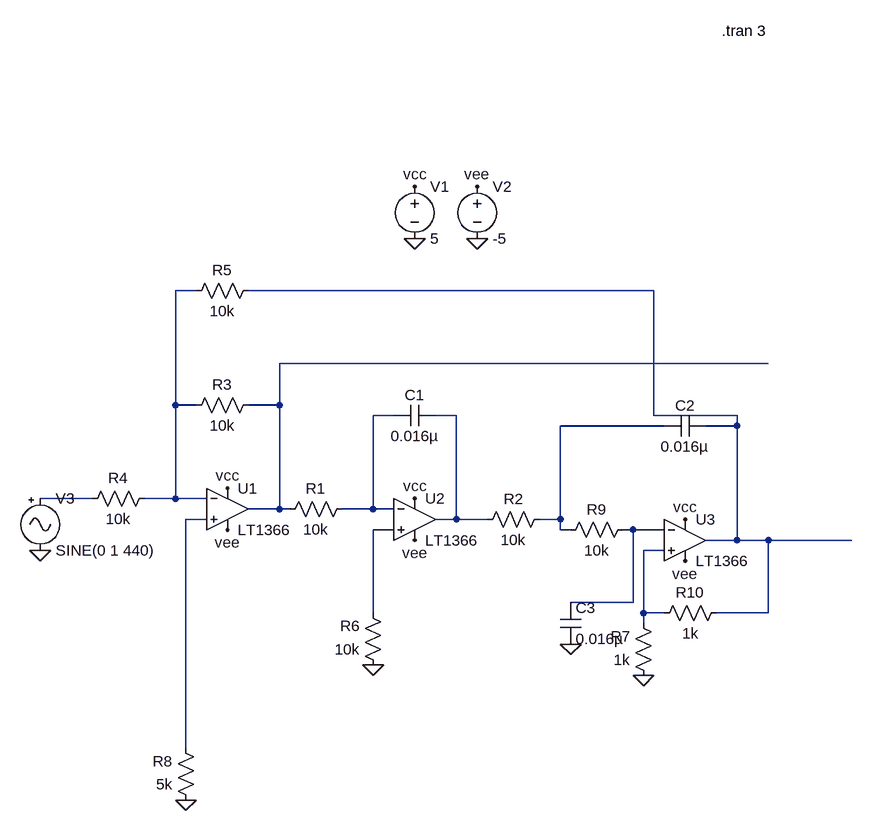
[diagram p0: schematic Draft35.asc]
Draft35.asc, the LTspice schematic file:
Version 4
SHEET 1 964 896
WIRE -48 96 -80 96
WIRE 656 96 32 96
WIRE 832 208 80 208
WIRE -80 272 -80 96
WIRE -48 272 -80 272
WIRE 80 272 80 208
WIRE 80 272 32 272
WIRE 256 288 224 288
WIRE 352 288 320 288
WIRE 656 288 656 96
WIRE 784 288 656 288
WIRE 672 304 512 304
WIRE 784 304 784 288
WIRE 784 304 736 304
WIRE -208 416 -288 416
WIRE -80 416 -80 272
WIRE -80 416 -128 416
WIRE -32 416 -80 416
WIRE 80 432 80 272
WIRE 80 432 32 432
WIRE 96 432 80 432
WIRE 224 432 224 288
WIRE 224 432 176 432
WIRE 256 432 224 432
WIRE -32 448 -64 448
WIRE 352 448 352 288
WIRE 352 448 320 448
WIRE 400 448 352 448
WIRE 512 448 512 304
WIRE 512 448 480 448
WIRE 256 464 224 464
WIRE 512 464 512 448
WIRE 528 464 512 464
WIRE 624 464 608 464
WIRE 672 464 624 464
WIRE 784 480 784 304
WIRE 784 480 736 480
WIRE 832 480 784 480
WIRE 960 480 832 480
WIRE 672 496 640 496
WIRE 624 576 624 464
WIRE 624 576 528 576
WIRE 224 592 224 464
WIRE 640 592 640 496
WIRE 672 592 640 592
WIRE 832 592 832 480
WIRE 832 592 752 592
WIRE 640 608 640 592
WIRE -64 800 -64 448
FLAG 384 16 0
FLAG 288 16 0
FLAG 288 -64 vcc
FLAG 384 -64 vee
FLAG 0 400 vcc
FLAG 288 416 vcc
FLAG 704 448 vcc
FLAG 704 512 vee
FLAG 288 480 vee
FLAG 0 464 vee
FLAG -64 880 0
FLAG 224 672 0
FLAG 640 688 0
FLAG -288 496 0
FLAG 528 640 0
SYMBOL voltage 288 -80 R0
SYMATTR InstName V1
SYMATTR Value 5
SYMBOL voltage 384 -80 R0
SYMATTR InstName V2
SYMATTR Value -5
SYMBOL Opamps/LT1366 0 368 R0
SYMATTR InstName U1
SYMBOL Opamps/LT1366 288 384 R0
SYMATTR InstName U2
SYMBOL Opamps/LT1366 704 416 R0
SYMATTR InstName U3
SYMBOL res 192 416 R90
WINDOW 0 0 56 VBottom 2
WINDOW 3 32 56 VTop 2
SYMATTR InstName R1
SYMATTR Value 10k
SYMBOL res 496 432 R90
WINDOW 0 0 56 VBottom 2
WINDOW 3 32 56 VTop 2
SYMATTR InstName R2
SYMATTR Value 10k
SYMBOL res 48 256 R90
WINDOW 0 0 56 VBottom 2
WINDOW 3 32 56 VTop 2
SYMATTR InstName R3
SYMATTR Value 10k
SYMBOL res -112 400 R90
WINDOW 0 0 56 VBottom 2
WINDOW 3 32 56 VTop 2
SYMATTR InstName R4
SYMATTR Value 10k
SYMBOL res 48 80 R90
WINDOW 0 0 56 VBottom 2
WINDOW 3 32 56 VTop 2
SYMATTR InstName R5
SYMATTR Value 10k
SYMBOL res 240 688 R180
WINDOW 0 36 76 Left 2
WINDOW 3 36 40 Left 2
SYMATTR InstName R6
SYMATTR Value 10k
SYMBOL res 656 704 R180
WINDOW 0 36 76 Left 2
WINDOW 3 36 40 Left 2
SYMATTR InstName R7
SYMATTR Value 1k
SYMBOL res -48 896 R180
WINDOW 0 36 76 Left 2
WINDOW 3 36 40 Left 2
SYMATTR InstName R8
SYMATTR Value 5k
SYMBOL cap 320 272 R90
WINDOW 0 0 32 VBottom 2
WINDOW 3 32 32 VTop 2
SYMATTR InstName C1
SYMATTR Value 0.016µ
SYMBOL cap 736 288 R90
WINDOW 0 0 32 VBottom 2
WINDOW 3 32 32 VTop 2
SYMATTR InstName C2
SYMATTR Value 0.016µ
SYMBOL Misc/signal -288 400 R0
SYMATTR InstName V3
SYMATTR Value SINE(0 1 440)
SYMBOL res 624 448 R90
WINDOW 0 0 56 VBottom 2
WINDOW 3 32 56 VTop 2
SYMATTR InstName R9
SYMATTR Value 10k
SYMBOL cap 512 576 R0
SYMATTR InstName C3
SYMATTR Value 0.016µ
SYMBOL res 768 576 R90
WINDOW 0 0 56 VBottom 2
WINDOW 3 32 56 VTop 2
SYMATTR InstName R10
SYMATTR Value 1k
TEXT 760 -304 Left 2 !.tran 3

The netlist it stands for:
* Draft35.asc
V1 vcc 0 5
V2 vee 0 -5
XU1 N008 N001 vcc vee N003 LT1366  ; pins In+ In- V+ V- OUT
XU2 N009 N004 vcc vee N005 LT1366  ; pins In+ In- V+ V- OUT
XU3 N011 N010 vcc vee N002 LT1366  ; pins In+ In- V+ V- OUT
R1 N004 N003 10k
R2 N006 N005 10k
R3 N003 N001 10k
R4 N001 N007 10k
R5 N002 N001 10k
R6 0 N009 10k
R7 0 N011 1k
R8 0 N008 5k
C1 N005 N004 0.016µ
C2 N002 N006 0.016µ
V3 N007 0 SINE(0 1 440)
R9 N010 N006 10k
C3 N010 0 0.016µ
R10 N002 N011 1k
.tran 3
.lib LTC.lib
.backanno
.end